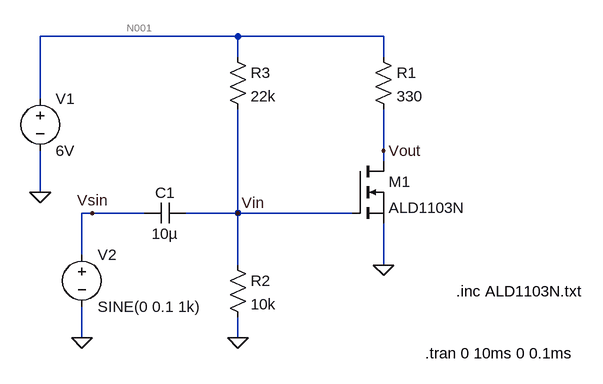
[diagram p0: schematic exp1.asc]
exp1.asc, the LTspice schematic file:
Version 4.1
SHEET 1 1072 680
WIRE 448 -96 144 -96
WIRE 672 -96 448 -96
WIRE 448 -64 448 -96
WIRE 672 -64 672 -96
WIRE 144 0 144 -96
WIRE 672 80 672 16
WIRE 672 96 672 80
WIRE 144 144 144 80
WIRE 224 176 208 176
WIRE 304 176 224 176
WIRE 448 176 448 16
WIRE 448 176 368 176
WIRE 624 176 448 176
WIRE 208 240 208 176
WIRE 448 256 448 176
WIRE 672 256 672 192
WIRE 208 368 208 320
WIRE 448 368 448 336
FLAG 208 368 0
FLAG 448 368 0
FLAG 144 144 0
FLAG 672 256 0
FLAG 672 80 Vout
FLAG 448 176 Vin
FLAG 224 176 Vsin
SYMBOL voltage 144 -16 R0
WINDOW 123 0 0 Left 0
WINDOW 39 0 0 Left 0
SYMATTR InstName V1
SYMATTR Value 6V
SYMBOL voltage 208 224 R0
WINDOW 123 0 0 Left 0
WINDOW 39 0 0 Left 0
SYMATTR InstName V2
SYMATTR Value SINE(0 0.1 1k)
SYMBOL cap 368 160 R90
WINDOW 0 0 32 VBottom 2
WINDOW 3 32 32 VTop 2
SYMATTR InstName C1
SYMATTR Value 10µ
SYMBOL res 656 -80 R0
SYMATTR InstName R1
SYMATTR Value 330
SYMBOL res 432 240 R0
SYMATTR InstName R2
SYMATTR Value 10k
SYMBOL res 432 -80 R0
SYMATTR InstName R3
SYMATTR Value 22k
SYMBOL nmos 624 96 R0
SYMATTR InstName M1
SYMATTR Value ALD1103N
TEXT 784 296 Left 2 !.inc ALD1103N.txt
TEXT 736 392 Left 2 !.tran 0 10ms 0 0.1ms

The netlist it stands for:
* exp1.asc
V1 N001 0 6V
V2 Vsin 0 SINE(0 0.1 1k)
C1 Vin Vsin 10µ
R1 N001 Vout 330
R2 Vin 0 10k
R3 N001 Vin 22k
M1 Vout Vin 0 0 ALD1103N
.model NMOS NMOS
.model PMOS PMOS
.lib standard.mos
.inc ALD1103N.txt
.tran 0 10ms 0 0.1ms
.backanno
.end

* Results of the author's LTspice run, read from the files saved beside the schematic
* Operating Point, zero values left out:
*   V(vout) = 4.319 V
*   V(n001) = 6 V
*   V(vin) = 1.875 V
*   I(V1) = -5.281 mA
*   I(R2) = 187.5 µA
*   I(R3) = 187.5 µA
*   Id(M1) = 5.094 mA
*   Is(M1) = -5.094 mA
*   Ib(M1) = -4.33 pA
*   I(R1) = 5.094 mA
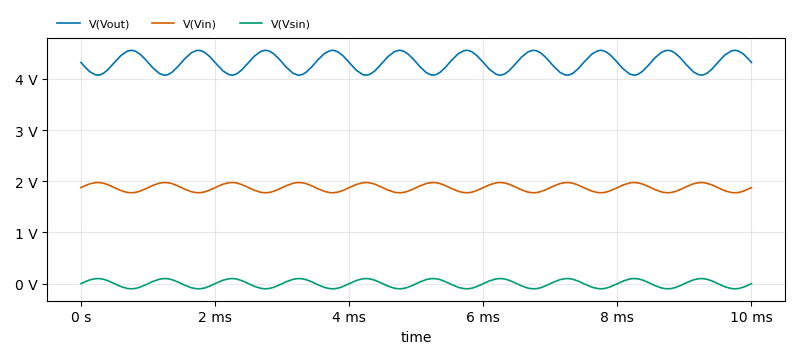
[diagram p1: Transient Analysis of exp1.asc, plotted from the saved traces]
* Transient Analysis, 1 run:
*   V(Vout): min 4.071 V, max 4.555 V, average 4.316 V, rms 4.32 V, last 4.319 V
*   V(Vin): min 1.775 V, max 1.975 V, average 1.875 V, rms 1.876 V, last 1.875 V
*   V(Vsin): min -100 mV, max 100 mV, average 11.6 µV, rms 71.65 mV, last 0 V